# EAGLE design Adapter-CMRI8-line-stall-motor-adapter (EAGLE 7.7.0)
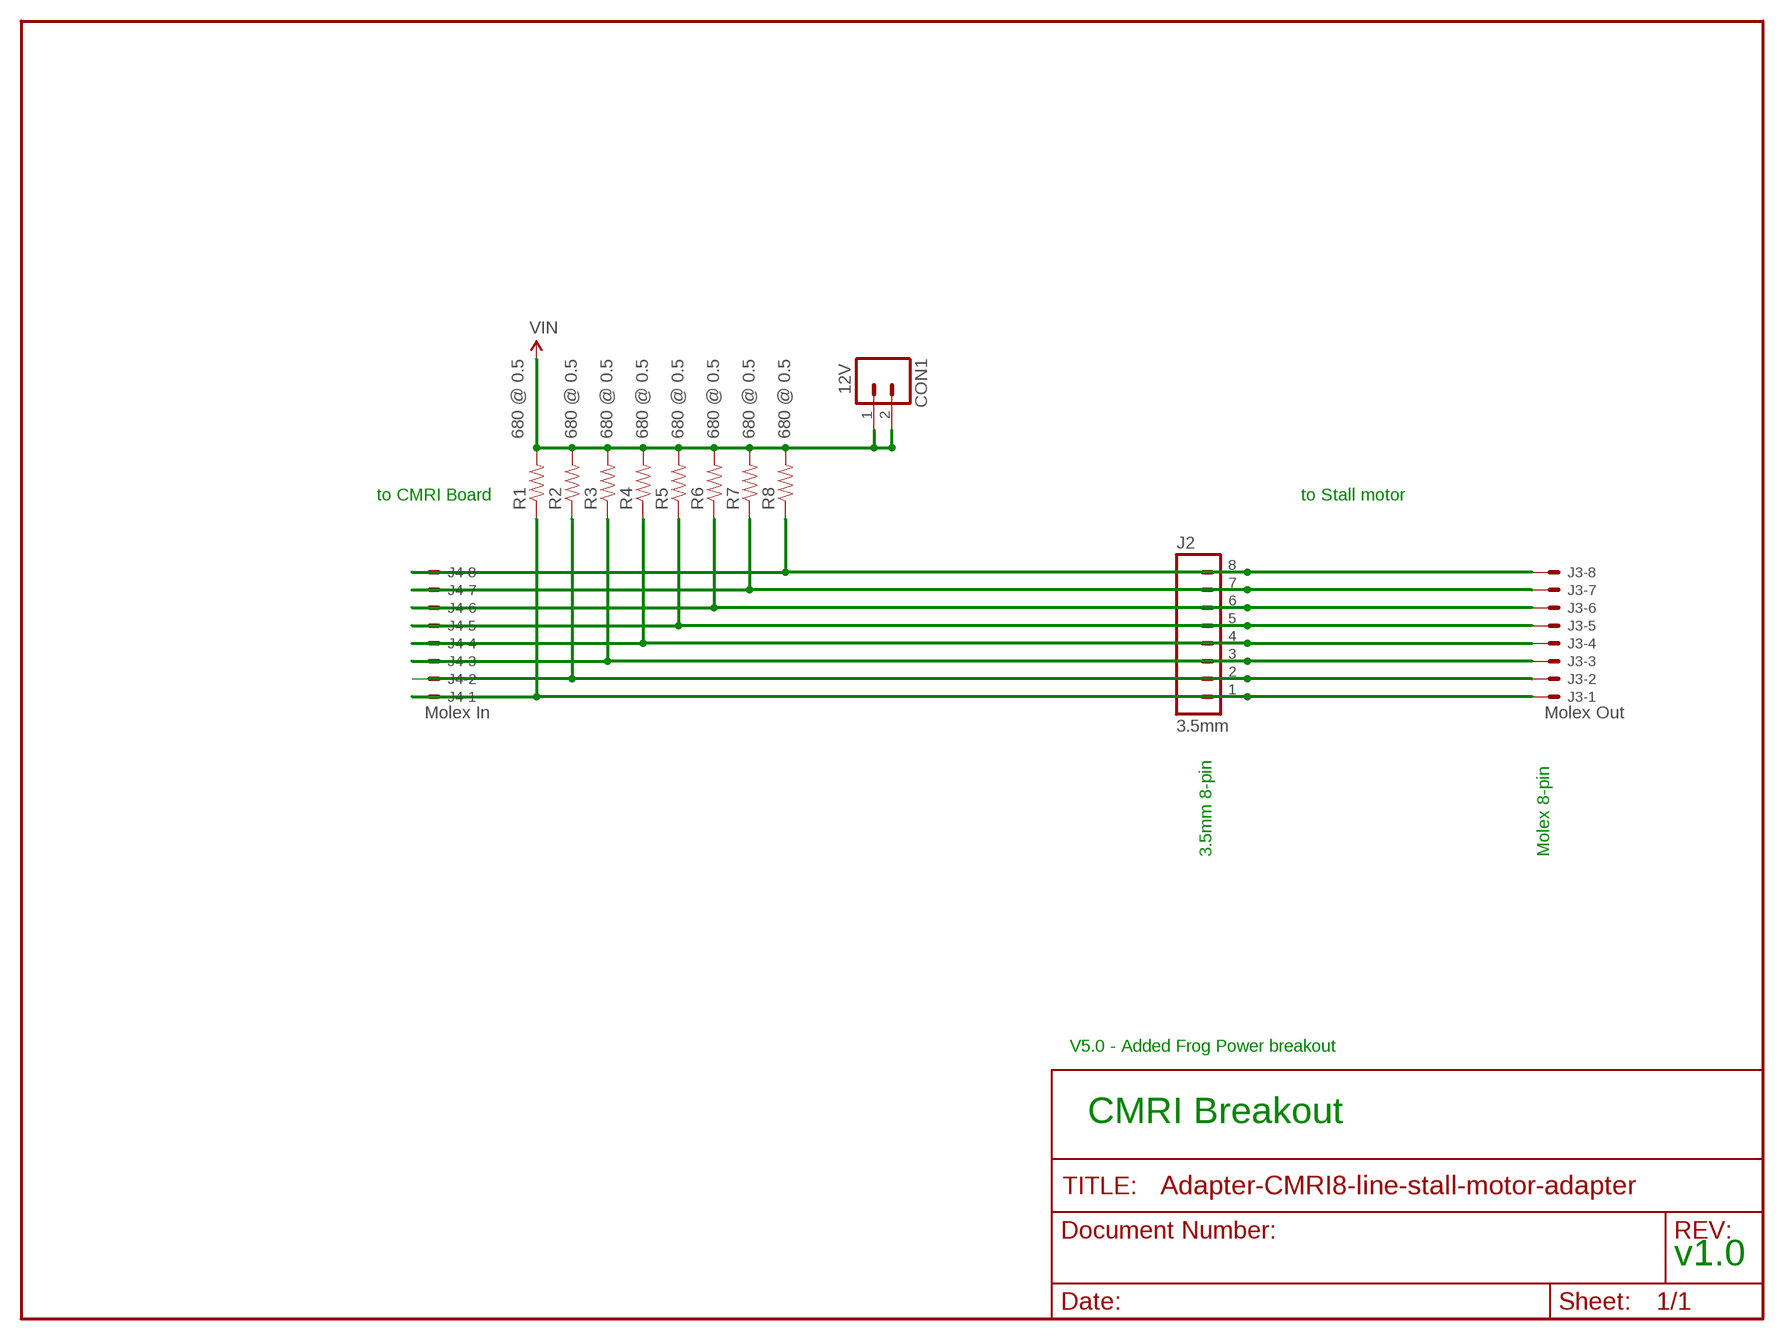
[diagram p0: schematic, sheet 1]

## Parts
CON1  12V  CONNECTOR-M023.5MM-LOCK  [SCREWTERMINAL-3.5MM-2_LOCK]
J2  3.5mm  CONNECTOR-M083.5MM-8  [SCREWTERMINAL-3.5MM-8]
J3  Molex Out  KK-156-8F  [KK-156-8-F]
J4  Molex In  KK-156-8F  [KK-156-8-F]
R1  680 @ 0.5  RESISTORPTH-1/2W  [AXIAL-0.5]
R2  680 @ 0.5  RESISTORPTH-1/2W  [AXIAL-0.5]
R3  680 @ 0.5  RESISTORPTH-1/2W  [AXIAL-0.5]
R4  680 @ 0.5  RESISTORPTH-1/2W  [AXIAL-0.5]
R5  680 @ 0.5  RESISTORPTH-1/2W  [AXIAL-0.5]
R6  680 @ 0.5  RESISTORPTH-1/2W  [AXIAL-0.5]
R7  680 @ 0.5  RESISTORPTH-1/2W  [AXIAL-0.5]
R8  680 @ 0.5  RESISTORPTH-1/2W  [AXIAL-0.5]

## Nets
L2: J2.2 J3.2 J4.2 R2.P$1
L3: J2.3 J3.3 J4.3 R3.P$1
L5: J2.5 J3.5 J4.5 R5.P$1
L6: J2.6 J3.6 J4.6 R6.P$1
L7: J2.7 J3.7 J4.7 R7.P$1
L8: J2.8 J3.8 J4.8 R8.P$1
N$1: J2.1 J3.1 J4.1 R1.P$1
N$8: J2.4 J3.4 J4.4 R4.P$1
VIN: CON1.1(A) CON1.2(B) R1.P$2 R2.P$2 R3.P$2 R4.P$2 R5.P$2 R6.P$2 R7.P$2 R8.P$2

## Notes on the sheet
- to CMRI Board | to Stall motor
- 3.5mm 8-pin | Molex 8-pin
- V5.0 - Added Frog Power breakout
- CMRI Breakout
- v1.0

## Library data of the parts
CON1 = SPCoast:CONNECTOR-M02: PHOENIX CONNECTOR
J2 = SPCoast:CONNECTOR-M08: Header 8 Standard 8-pin 0.1" header. Use with straight break away headers (SKU : PRT-00116), right angle break away headers (PRT-00553), swiss pins (PRT-00743), machine pins (PRT-00117), and female headers (PRT-00115).
J3 J4 = SPCoast:KK-156-8: KK 156 HEADER Source: http://www.molex.com/pdm_docs/sd/026604100_sd.pdf; OC_FARNELL: unknown; OC_NEWARK: unknown
R1-R8 = SparkFun-Resistors:RESISTOR: Resistor Basic schematic elements and footprints for 0603, 1206, and PTH resistors.

## Net classes
0 default: width 0.254 mm

## Board
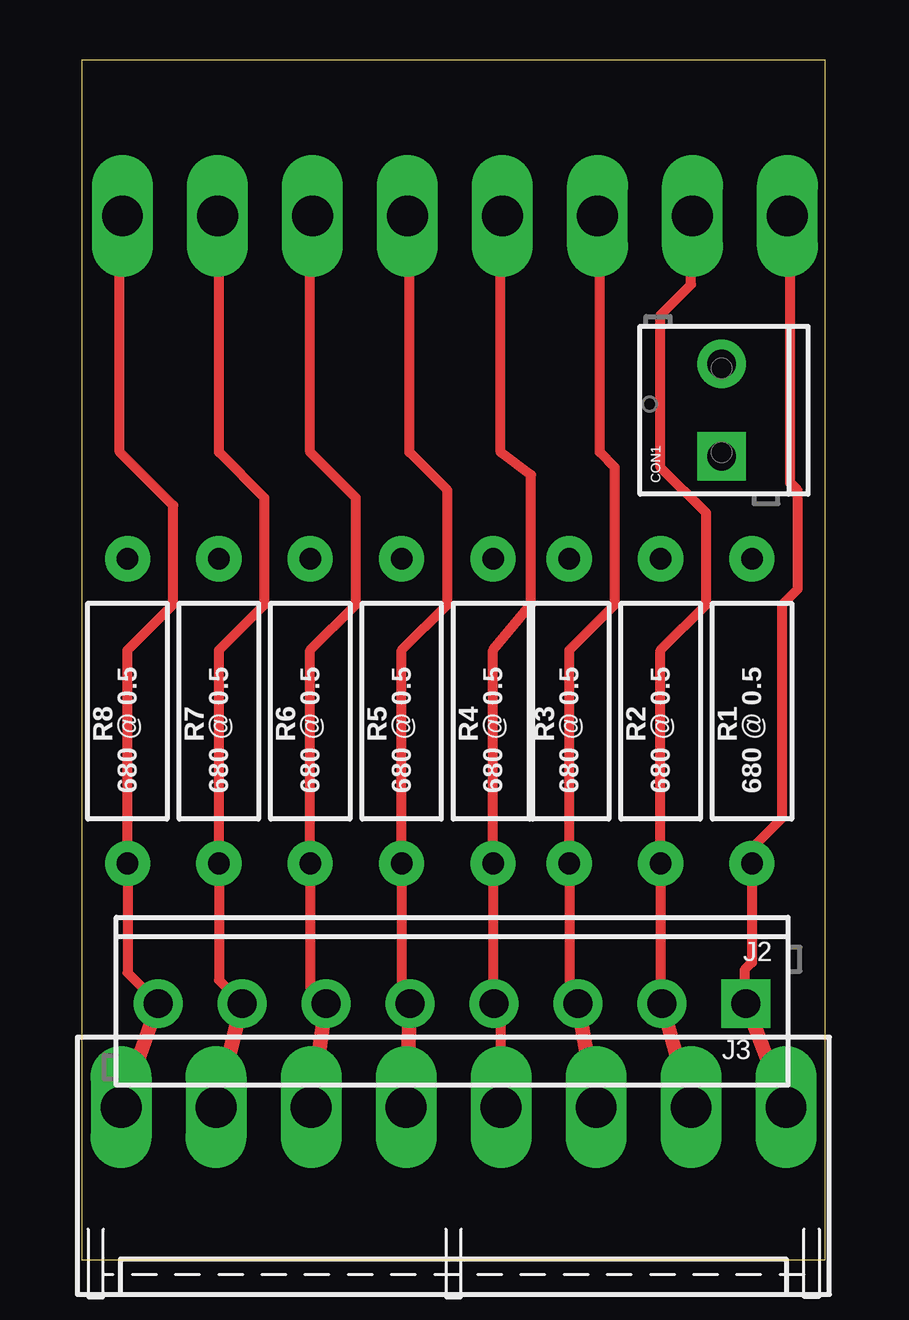
[diagram p1: board, top side]
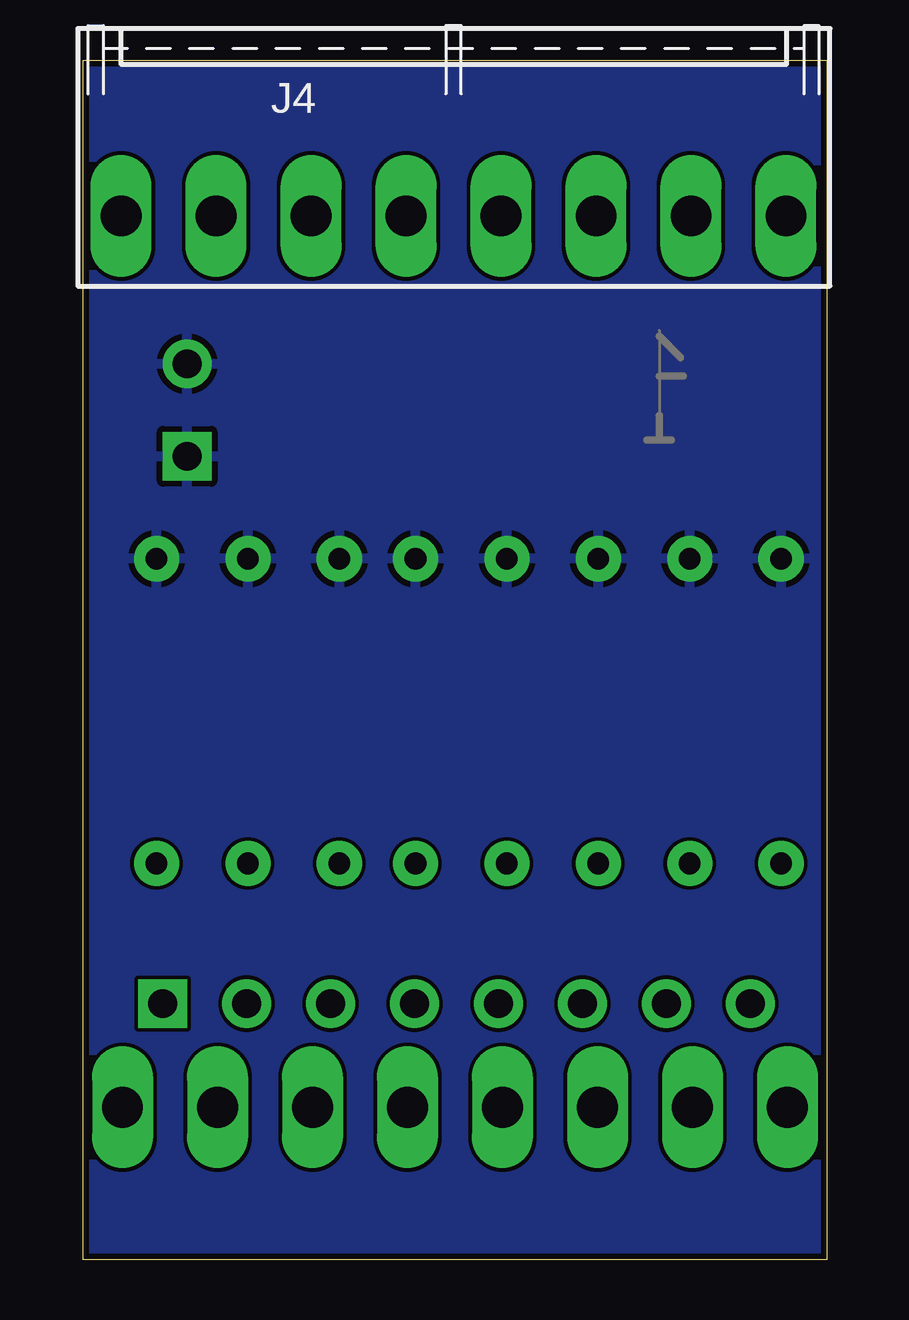
[diagram p2: board, bottom side, seen from below]

Size 31 x 50 mm. Coordinates in mm from the lower left corner, seen from the top.
Outline: 0,0 31,0 31,50 0,50 0,0
Copper layers (1*16): Top 0.035mm / dielectric 1.5mm / Bottom 0.035mm
Design rules "Fusion_eagle_rule_v1.1": minimum track width 6mil, minimum drill 12mil, track to track 6mil, track to pad 6mil, pad to pad 6mil, via to via 6mil, smd to smd 0mil, copper to edge 10mil, drill to drill 10mil, minimum pad ring 10mil, minimum via ring 6mil, stop-mask expansion 2mil, vias tented up to drill 100mil, thermal gap 10mil

### Footprints (pad centres in the part's own frame; a part is rotated, then mirrored left to right if it is on the bottom)
SCREWTERMINAL-3.5MM-2_LOCK = drill 1.2 pad 2.032 square: 1 -0.178,0 | drill 1.2 pad 2.032: 2 3.678,0
SCREWTERMINAL-3.5MM-8 = drill 1.2 pad 2.032 square: 1 0,0 | drill 1.2 pad 2.032: 2 3.5,0; 3 7,0; 4 10.5,0; 5 14,0; 6 17.5,0; 7 21,0; 8 24.5,0
KK-156-8-F = drill 1.7 pad 2.184 long: 1 -13.86,0; 2 -9.9,0; 3 -5.94,0; 4 -1.98,0; 5 1.98,0; 6 5.94,0; 7 9.9,0; 8 13.86,0
AXIAL-0.5 = drill 0.9 pad 1.88: P$1 -6.35,0; P$2 6.35,0

### Placement (x,y rotation side)
CON1  26.67,33.66 90 top
J2  27.69,10.67 180 top
J3  15.5,6.35 180 top
J4  15.56,43.5 0 bottom
R1  27.94,22.86 90 top
R2  24.13,22.86 90 top
R3  20.32,22.86 90 top
R4  17.14,22.86 90 top
R5  13.34,22.86 90 top
R6  9.53,22.86 90 top
R7  5.71,22.86 90 top
R8  1.91,22.86 90 top
U$1  [CA-PROP65WARNING]  19.05,21.59 0 top
U$2  [MRCSLOGOBTM]  0.64,33.66 0 top

### Tracks (layer width: path | path; a pad name or v marks a point on that pad's centre or on a via)
L2
  Top 0.406: J2.2 24.13,10.72 R2.P$1 24.13,25.4 26.04,27.3 26.04,31.11 24.13,33.02 24.13,39.37 25.4,40.64 25.4,43.44 J4.2
  Top 0.61: J2.2 J3.2
L3
  Top 0.406: J2.3 20.32,11.03 R3.P$1 20.32,25.4 22.23,27.3 22.23,33.02 21.59,33.66 21.59,43.41 J4.3
  Top 0.61: J2.3 J3.3
L5
  Top 0.406: J2.5 13.34,11.02 R5.P$1 13.34,25.4 15.24,27.3 15.24,32.07 13.65,33.66 13.65,43.42 J4.5
  Top 0.61: J2.5 J3.5
L6
  Top 0.406: J2.6 9.53,11.33 R6.P$1 9.53,25.4 11.43,27.3 11.43,31.75 9.53,33.66 9.53,43.41 J4.6
  Top 0.61: J2.6 J3.6
L7
  Top 0.406: J2.7 5.71,11.64 R7.P$1 5.71,25.4 7.62,27.3 7.62,31.75 5.71,33.66 5.71,43.44 J4.7
  Top 0.61: J2.7 J3.7
L8
  Top 0.406: J2.8 1.91,11.95 R8.P$1 1.91,25.4 3.81,27.3 3.81,31.43 1.59,33.66 1.59,43.39 J4.8
  Top 0.61: J2.8 J3.8
N$1
  Top 0.406: J2.1 27.62,10.73 27.62,12.06 27.94,12.38 R1.P$1 27.94,17.14 29.21,18.41 29.21,27.3 29.84,27.94 29.84,32.07 29.53,32.38 29.53,43.39 J4.1
  Top 0.61: J2.1 J3.1
N$8
  Top 0.406: J3.4 17.48,10.37 J2.4 17.14,10.71 R4.P$1 17.14,25.4 18.73,27.3 18.73,32.7 17.46,33.66 17.46,43.42 J4.4
VIN
  pour Bottom: 0,0 31.11,0 31.11,50.16 0,50.16

### Text on the board
tDocu: CMRI 8 Line Stall / MotorAdapter / V 1.0 20211204 / Seth Neumann | 8 | 1 | 2021.02 | v1.0 | 0.100 | 3.5mm | 8 | 1 | 0.156
bDocu: Seth Neumann / John Plocher | CMRI 8 Line Stall Motor Adapter | Made in the PCR, Coast Division, NMRA | Solder Side
_tNames: CON1 | R8 | R7 | R6 | R5 | R4 | R3 | R2 | R1 | J2 | J3
_bNames: J4